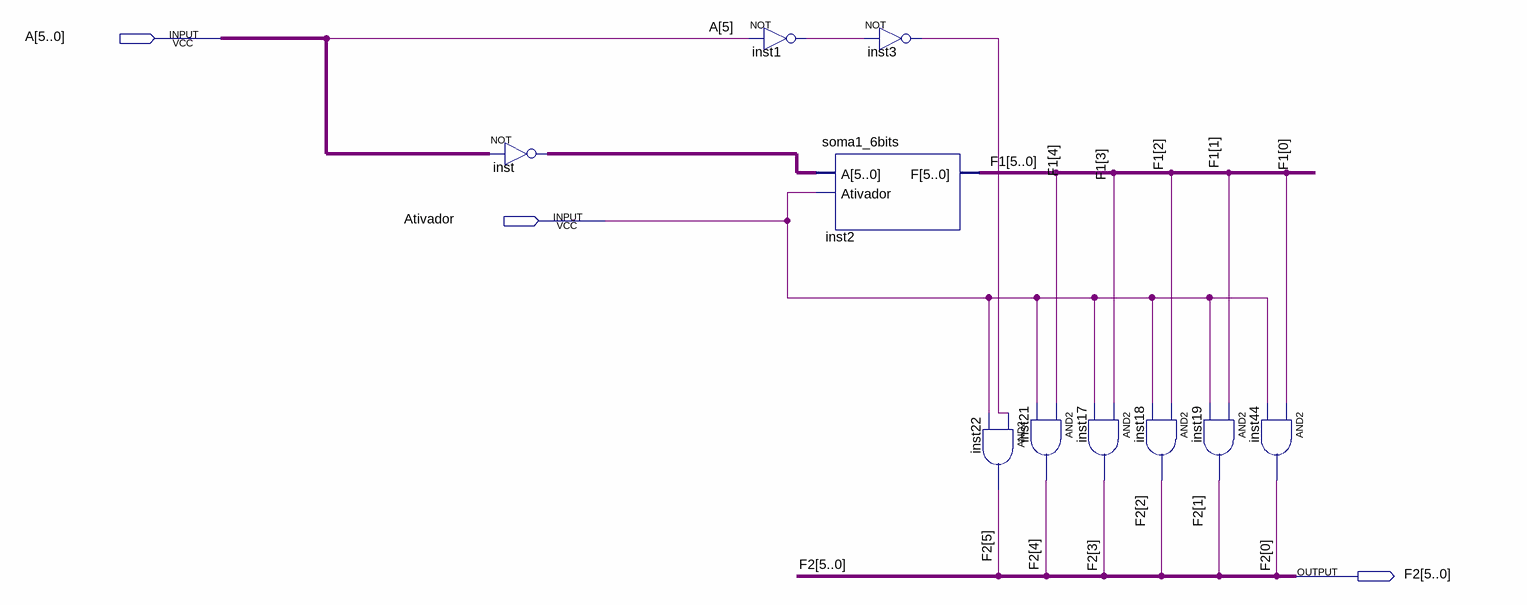
[diagram p0: schematic sheet]
// Quartus schematic complemento_de_2_6bits.bdf as structural Verilog: 10 symbols, 3 pins
module complemento_de_2_6bits (
  input  [5:0] A,
  input  Ativador,
  output [5:0] F2
);

  wire inst1_out, inst3_out;
  wire [5:0] F1, inst_out;

  assign inst_out = ~A;  // NOT inst, 6 bits wide
  not inst1 (inst1_out, A[5]);
  soma1_6bits inst2 (.A(inst_out), .Ativador(Ativador), .F(F1));
  not inst3 (inst3_out, inst1_out);
  and inst22 (F2[5], inst3_out, Ativador);
  and inst17 (F2[3], F1[3], Ativador);
  and inst21 (F2[4], F1[4], Ativador);
  and inst18 (F2[2], F1[2], Ativador);
  and inst19 (F2[1], F1[1], Ativador);
  and inst44 (F2[0], F1[0], Ativador);
endmodule
